# Altium schematic sheet Sheet1.SchDoc
size A4
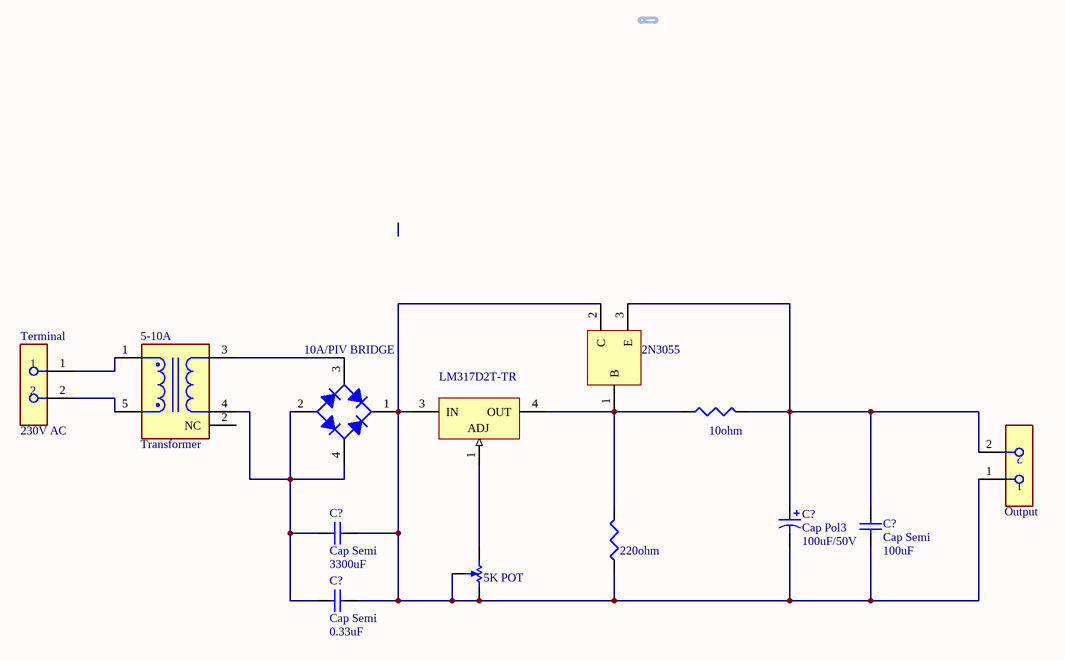
[diagram p0: Sheet1.SchDoc]

## Parts
(Parts that share a designator on the sheet are numbered #1, #2 ... from top to bottom, then left to right.)
5-10A  Transformer  [FP-MABA-007159-000000-MFG]
?#1  10A/PIV BRIDGE  [FAIR-SDIP-4_V]
?#2  2N3055  [ONSC-TO-247-3-340L-02]
?#3  LM317D2T-TR  [TO-263_N]
?#4  value 10ohm  [J1-0603]
?#5  Output  [FP-38969-0002-MFG]
?#6  value 220ohm  [J1-0603]
?#7  5K POT  [POT4MM-2]
C?#1  Cap Semi  value 3300uF  [C1206]
C?#2  Cap Pol3  value 100uF/50V  [C0805]
C?#3  Cap Semi  value 100uF  [C1206]
C?#4  Cap Semi  value 0.33uF  [C1206]
Terminal  230V AC  [FP-38969-0002-MFG]

## Nets
Net5-10A_1: 5-10A.1(Secondary_Dot) Terminal.1
Net5-10A_3: 5-10A.3(Secondary) ?#1.3(C)
Net5-10A_4: 5-10A.4(Primary) ?#1.2(A) ?#1.4(C) C?#1.1 C?#4.1
Net5-10A_5: 5-10A.5(Primary_Dot) Terminal.2
Net?#1_1: ?#1.1(K) ?#2.2(C) ?#3.3(IN) ?#5.1 ?#6.1 ?#7.CW(+) ?#7.W C?#1.2 C?#2.2 C?#3.2 C?#4.2
Net?#2_1: ?#2.1(B) ?#3.4(OUT) ?#4.1 ?#6.2
Net?#2_3: ?#2.3(E) ?#4.2 ?#5.2 C?#2.1 C?#3.1
Net?#3_1: ?#3.1(ADJ) ?#7.CCW(-)

Not connected (* = marked no-connect by the designer): 5-10A 2(NC)

## Library data of the parts
5-10A = CMP-97499-000002-1: BALUN 4.5MHZ-3GHZ 1:1 6SMD FLAT; Power Rating: 250mW; Max DC Current: 30mA; Lead/Base Style: Gull Wing; Depth: 3.81mm; Lead Free: Lead Free; Turns Ratio: 1:1; Case/Package: SMD/SMT; Min Operating Temperature: -40°C; Length: 3.81mm; Width: 3.81mm; Mount: Surface Mount; Radiation Hardening: No; Number of Pins: 5; RoHS Compliant: Yes; Max Operating Temperature: 85°C; Termination: SMD/SMT; Height: 2.67mm; Packaging: Cut Tape; Package Quantity: 2000; Series: -
?#1 = CMP-2000-06153-1: Bridge Rectifier, 1.5 A, 1000 V, 4-Pin SDIP, RoHS, Tape and Reel; Manufacturer: FairchildSemiconductor; Configuration: Single; Peak Average Forward Current: 1.5@Ta=40CA; Peak Reverse Repetitive Voltage: 1000V; Peak Reverse Current: 5uA; Bridge Type: SinglePhase; Peak Forward Voltage: 1.1@1AV; Datasheet Version: Rev. 1.5, 05/2015; Package: 4SDIPSMD; Operating Temperature: -55to150°C; Package Reference: SDIP 4L; Datasheet URL: http://www.farnell.com/datasheets/1941063.pdf; Packaging: Tape&Reel; Manufacturer URL: https://www.fairchildsemi.com/; Mounting Technology: SurfaceMount; Category: BridgeRectifier; Package Description: 4-Pin Surface Mount Device, Body 8.28 x 6.35 mm, Pitch 5.1 mm; Mounting: SurfaceMount
?#2 = CMP-1048-01311-1: Complementary Silicon High-Power Transistor, 3-Pin TO-247, Pb-Free, Tube; Manufacturer: On Semiconductor; PartNumber: TIP36AG; IC Continuous (A): 25; Polarity: PNP; fT Min (MHz): 3; ComponentLink1Description: Manufacturer URL; Packing: Tube; ComponentLink1URL: http://www.onsemi.com/; PackageReference: TO-247-3-340L-02; RoHS: TRUE; DatasheetVersion: Rev. 6; Mounting Technology: Through Hole; ComponentLink2URL: http://www.onsemi.com/pub_link/Collateral/TIP35A-D.PDF; PackageVersion: Rev. F, 10/2011; PackageDescription: 3-Pin Flange Mount, Vertical Straight Lead, Body 16.005 x 5 mm, Pitch 5.45 mm; ComponentLink3Description: Package Specification; ComponentLink3URL: http://www.onsemi.cn/pub_link/Collateral/340L-02.PDF; ComponentLink2Description: Datasheet
?#3 = CMP-0244-00094-1: 1.5A, 1.2V to 37V Adjustable Voltage Regulator, 3-Pin D2PAK, Tape and Reel; DatasheetVersion: 1/11/2011; PackageVersion: 2011; PackageDescription: 3-Pin Transistor Outline Package 2.54 mm Pitch, 15.4 mm Lead Span (D2PAK); ComponentLink2URL: http://www.st.com/internet/com/TECHNICAL_RESOURCES/TECHNICAL_LITERATURE/DATASHEET/CD00000455.pdf; PackageReference: TO-263; ComponentLink1Description: Manufacturer URL; ComponentLink2Description: Datasheet; ComponentLink1URL: http://www.st.com
?#4 ?#6 = Res3: Resistor; Published: 8-Jun-2000; LatestRevisionDate: 29-May-2009; LatestRevisionNote: IPC-7351 Footprint Added.; PackageReference: J1-0603; Publisher: Altium Limited; PackageDescription: Chip Resistor
?#5 Terminal = CMP-00257-12872391-1: 38969-0002 12.70mm Pitch, Single Row Tri-Barrier Terminal Strip, without Mounting Ends, 2 Circuits; Manufacturer Lifecycle Status: ACTIVE; Voltage Rating: 600V; Wire Gauge (Min): 20AWG; Number of Positions: 2; Current Rating: 50A; Connector Type: Terminal Block; Wire/Cable Gauge: 18AWG; Wire Gauge (Max): 8AWG; Pitch: 12.7mm; Number of Rows: 1; Country of Origin: US; REACH SVHC: Unknown; Lifecycle Status: Production; Termination: Screw; Mount: Through Hole; Contact Material: Brass; Number of Circuits: 2; Orientation: Vertical; Number of Contacts: 2; Max Voltage Rating (AC): 600V; RoHS: Compliant; Max Operating Temperature: 120°C; Min Operating Temperature: -40°C; Contact Plating: Tin; NexarPartId: 12872391
?#7 = RPot SM: Square Trimming Potentiometer; Published: 17-Dec-2003; DatasheetVersion: Oct-2003; PackageReference: POT4MM-2; Publisher: Altium Limited; PackageDescription: Square Trimming Potentiometer; ComponentLink1Description: Manufacturer Link; ComponentLink1URL: http://bourns.com/2/search.html
C?#1 C?#3 C?#4 = Cap Semi: Capacitor (Semiconductor SIM Model); Published: 8-Jun-2000; LatestRevisionDate: 29-May-2009; LatestRevisionNote: IPC-7351 Footprint Added.; PackageReference: C1206; Publisher: Altium Limited; PackageDescription: Chip Capacitor
C?#2 = Cap Pol3: Polarized Capacitor (Surface Mount); Published: 8-Jun-2000; LatestRevisionDate: 29-May-2009; LatestRevisionNote: IPC-7351 Footprint Added.; PackageReference: C0805; Publisher: Altium Limited; PackageDescription: Chip Capacitor